# Altium schematic sheet JD1759S-NF-DIS.SCHDOC
size C
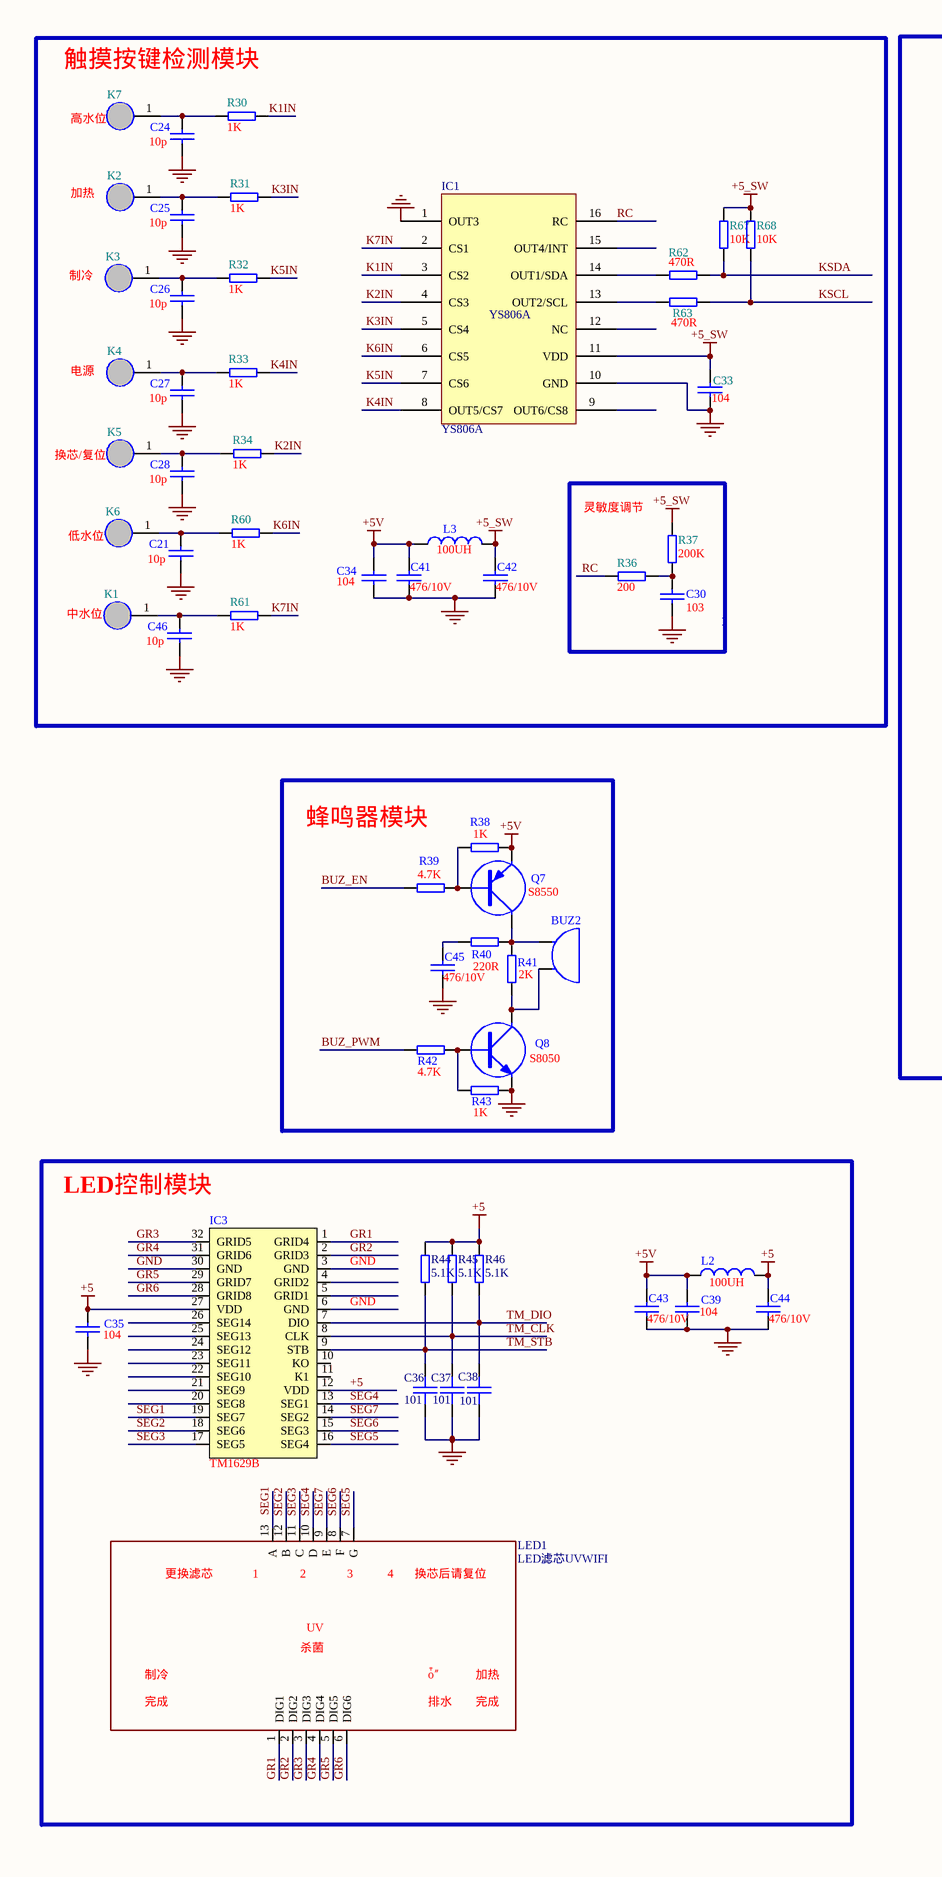
[diagram p0: JD1759S-NF-DIS.SCHDOC, left]
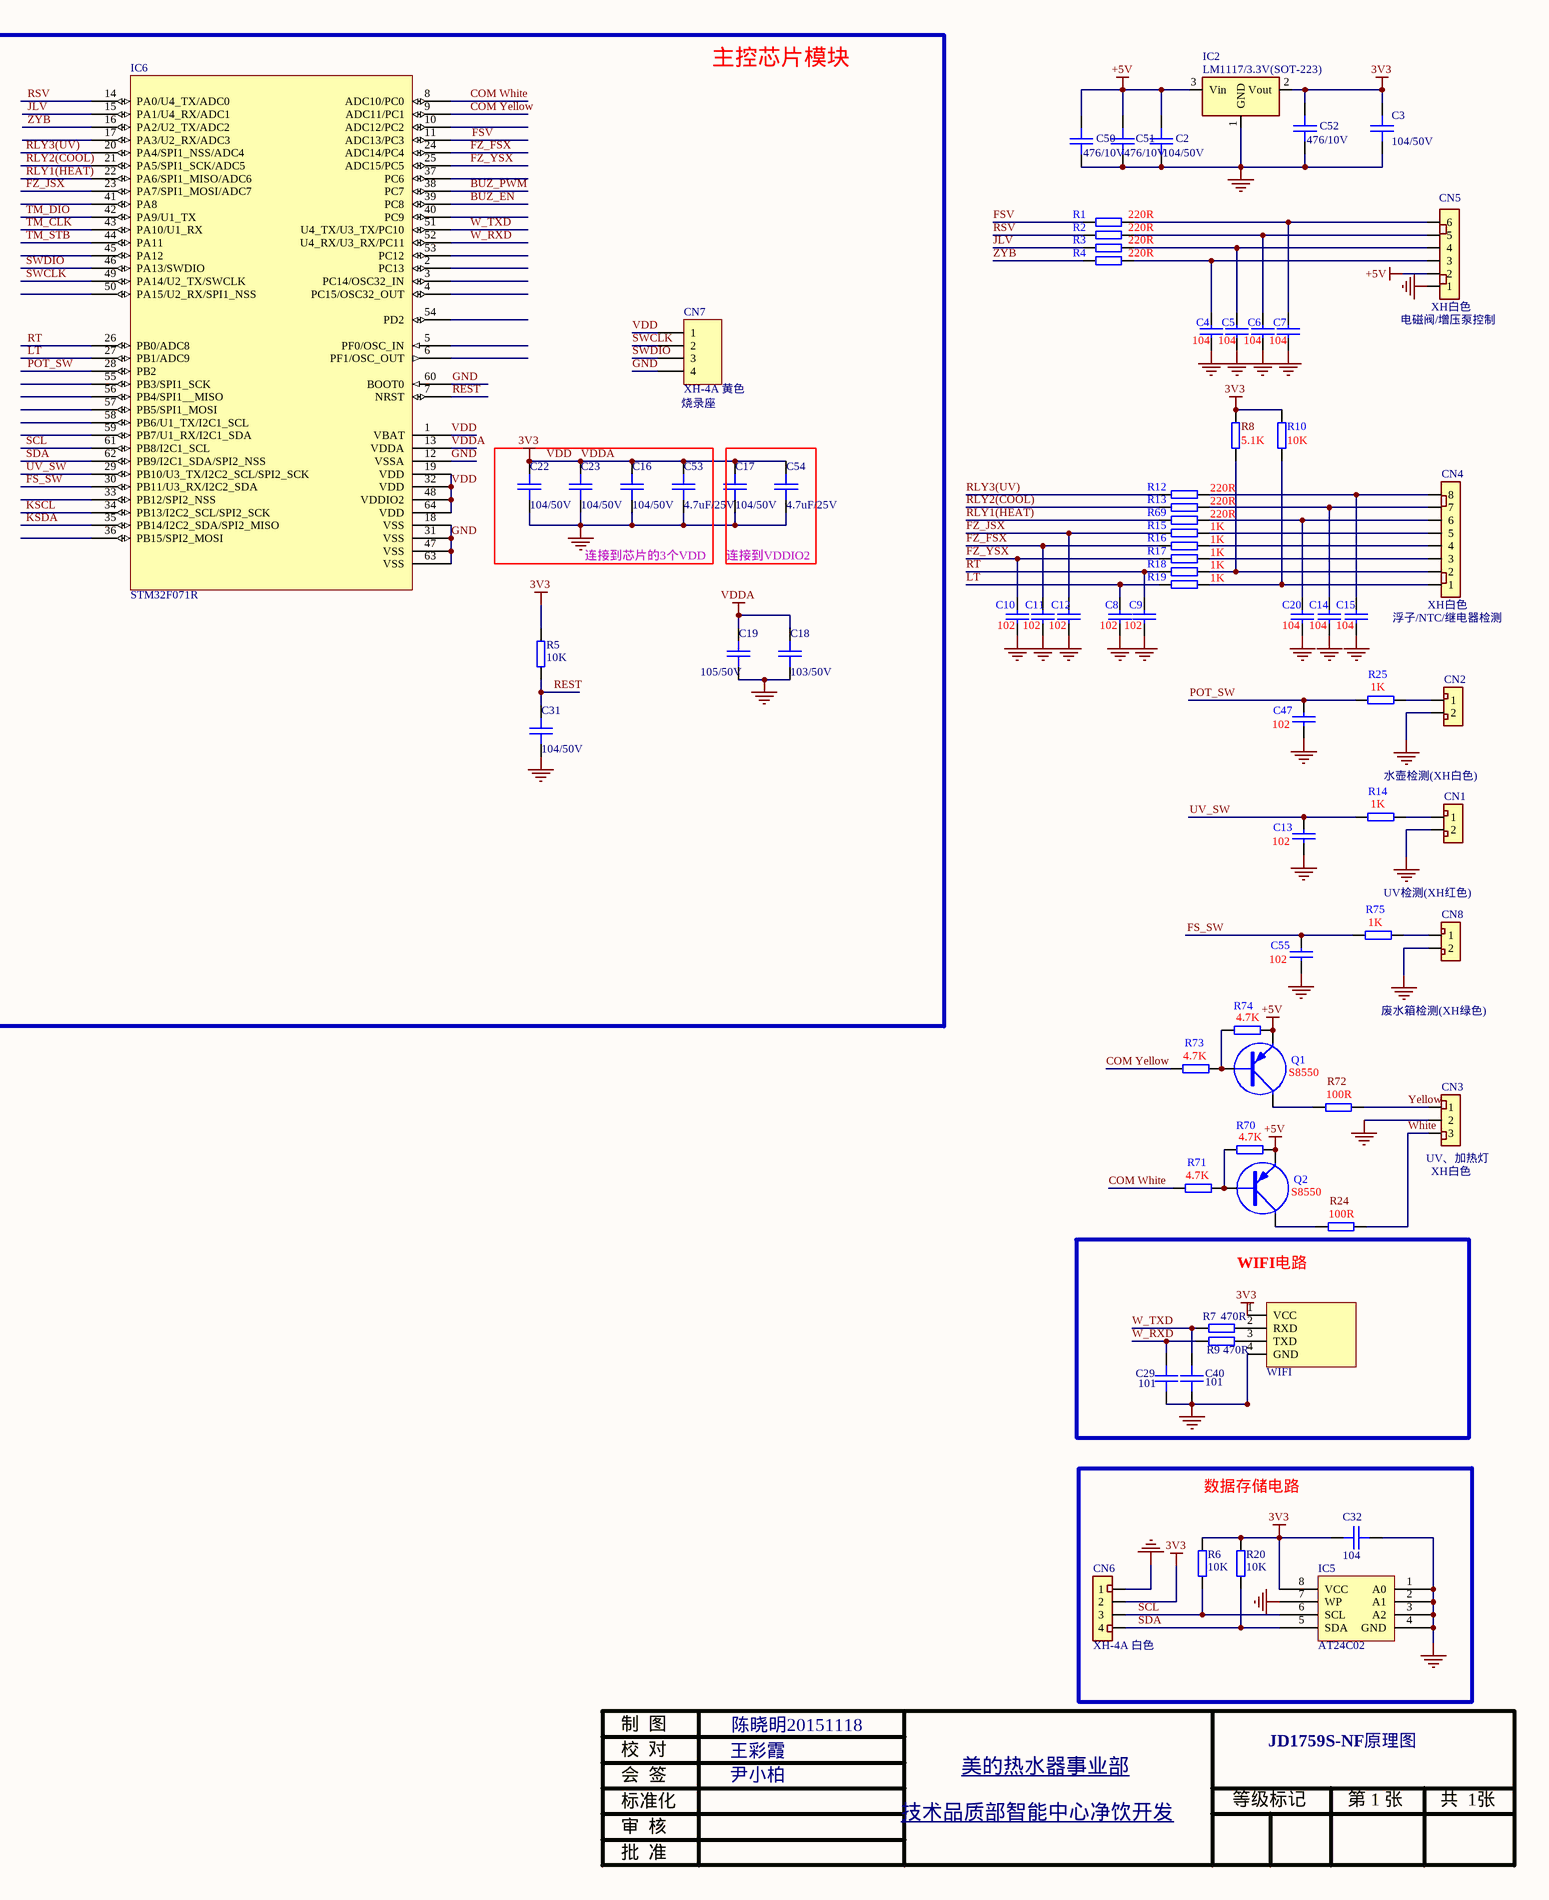
[diagram p1: JD1759S-NF-DIS.SCHDOC, right]

## Parts
BUZ2  (no value)  [BUZ1]
C2  104/50V  [C0805XG]
C3  104/50V  [C0805XG]
C4  104  [C0805XG]
C5  104  [C0805XG]
C6  104  [C0805XG]
C7  104  [C0805XG]
C8  102  [C0805XG]
C9  102  [C0805XG]
C10  102  [C0805XG]
C11  102  [C0805XG]
C12  102  [C0805XG]
C13  102  [C0805XG]
C14  104  [C0805XG]
C15  104  [C0805XG]
C16  104/50V  [C0805XG]
C17  104/50V  [C0805XG]
C18  103/50V  [C0805XG]
C19  105/50V  [C0805XG]
C20  104  [C0805XG]
C21  10p  [C0805XG]
C22  104/50V  [C0805XG]
C23  104/50V  [C0805XG]
C24  10p  [C0805XG]
C25  10p  [C0805XG]
C26  10p  [C0805XG]
C27  10p  [C0805XG]
C28  10p  [C0805XG]
C29  101  [C0805XG]
C30  103  [C0805XG]
C31  104/50V  [C0805XG]
C32  104  [C0805XG]
C33  104  [C0805XG]
C34  104  [C0805XG]
C35  104  [C0805XG]
C36  101  [C0805XG]
C37  101  [C0805XG]
C38  101  [C0805XG]
C39  104  [C0805XG]
C40  101  [C0805XG]
C41  476/10V  [C1206]
C42  476/10V  [C1206]
C43  476/10V  [C1206]
C44  476/10V  [C1206]
C45  476/10V  [C1206]
C46  10p  [C0805XG]
C47  102  [C0805XG]
C50  476/10V  [C1206]
C51  476/10V  [C1206]
C52  476/10V  [C1206]
C53  4.7uF/25V  [C0805XG]
C54  4.7uF/25V  [C0805XG]
C55  102  [C0805XG]
CN1  CN2  [CN2]  (value not drawn)
CN2  CN2  [CN2]  (value not drawn)
CN3  CN3  [CN3]  (value not drawn)
CN4  XH白色  [CN8]
CN5  XH白色  [CN6]
CN6  XH-4A 白色  [CN4]
CN7  XH-4A 黄色  [CN4]
CN8  CN2  [CN2]  (value not drawn)
IC1  YS806A  [SOP16]
IC2  LM1117/3.3V(SOT-223)  [SOT-223]
IC3  TM1629B  [SOP32]
IC4  WIFI  [WIFI]
IC5  AT24C02  [SOP8]
IC6  STM32F071R  [QFP64(0.5MM)]
K1  中水位  [KEY-T1 - 12]
K2  加热  [KEY-T1 - 12]
K3  制冷  [KEY-T1 - 12]
K4  电源  [KEY-T1 - 12]
K5  换芯/复位  [KEY-T1 - 12]
K6  低水位  [KEY-T1 - 12]
K7  高水位  [KEY-T1 - 12]
L2  100UH  [L100-5.7]
L3  100UH  [R1210]
LED1  LED滤芯UVWIFI  [LED滤芯UVWIFI]
Q1  S8550  [SOT23-BCE]
Q2  S8550  [SOT23-BCE]
Q7  S8550  [SOT23-BCE]
Q8  S8050  [SOT23-BCE]
R1  220R  [R0805XG]
R2  220R  [R0805XG]
R3  220R  [R0805XG]
R4  220R  [R0805XG]
R5  10K  [R0805XG]
R6  10K  [R0805XG]
R7  470R  [R0805XG]
R8  5.1K  [R0805XG]
R9  470R  [R0805XG]
R10  10K  [R0805XG]
R12  220R  [R0805XG]
R13  220R  [R0805XG]
R14  1K  [R0805XG]
R15  1K  [R0805XG]
R16  1K  [R0805XG]
R17  1K  [R0805XG]
R18  1K  [R0805XG]
R19  1K  [R0805XG]
R20  10K  [R0805XG]
R24  100R  [R1206]
R25  1K  [R0805XG]
R30  1K  [R0805XG]
R31  1K  [R0805XG]
R32  1K  [R0805XG]
R33  1K  [R0805XG]
R34  1K  [R0805XG]
R36  200  [R0805XG]
R37  200K  [R0805XG]
R38  1K  [R0805XG]
R39  4.7K  [R0805XG]
R40  220R  [R0805XG]
R41  2K  [R0805XG]
R42  4.7K  [R0805XG]
R43  1K  [R0805XG]
R44  5.1K  [R0805XG]
R45  5.1K  [R0805XG]
R46  5.1K  [R0805XG]
R60  1K  [R0805XG]
R61  1K  [R0805XG]
R62  470R  [R0805XG]
R63  470R  [R0805XG]
R67  10K  [R0805XG]
R68  10K  [R0805XG]
R69  220R  [R0805XG]
R70  4.7K  [R0805XG]
R71  4.7K  [R0805XG]
R72  100R  [R1206]
R73  4.7K  [R0805XG]
R74  4.7K  [R0805XG]
R75  1K  [R0805XG]

## Blocks framed on the sheet
触摸按键检测模块: C21 C24-C28 C30 C33 C34 C41 C42 C46 IC1 K1-K7 L3 R30-R34 R36 R37 R60-R63 R67 R68
主控芯片模块: C18 C19 C31 CN7 IC6 R5
连接到芯片的3个VDD: C16 C22 C23 C53
连接到VDDIO2: C17 C54
蜂鸣器模块: BUZ2 C45 Q7 Q8 R38-R43
LED控制模块: C35-C39 C43 C44 IC3 L2 LED1 R44-R46
WIFI电路: C29 C40 IC4 R7 R9
数据存储电路: C32 CN6 IC5 R6 R20

## Nets
+5: C35.2 C44.2 IC3.12(VDD) IC3.27(VDD) L2.1 R44.2 R45.2 R46.2
+5_SW: C33.2 C42.2 IC1.11(VDD) L3.1 R37.1 R67.1 R68.1
+5V: C2.2 C34.2 C39.2 C41.2 C43.2 C50.2 C51.2 CN5.2 IC2.3(Vin) L2.2 L3.2 Q1.E Q2.E Q7.E R38.2 R70.2 R74.2
GND: C2.1 C3.2 C4.2 C5.2 C6.2 C7.2 C8.2 C9.2 C10.2 C11.2 C12.2 C13.2 C14.2 C15.2 C16.1 C17.1 C18.1 C19.1 C20.2 C21.2 C22.1 C23.1 C24.2 C25.2 C26.2 C27.2 C28.2 C29.1 C30.2 C31.1 C32.2 C33.1 C34.1 C35.1 C36.1 C37.1 C38.1 C39.1 C40.1 C41.1 C42.1 C43.1 C44.1 C45.1 C46.2 C47.2 C50.1 C51.1 C52.1 C53.1 C54.1 C55.2 CN1.2 CN2.2 CN3.2 CN5.1 CN6.1 CN7.4 CN8.2 IC1.1(OUT3) IC1.10(GND) IC2.1(GND) IC3.3(GND) IC3.6(GND) IC3.30(GND) IC4.4(GND) IC5.1(A0) IC5.2(A1) IC5.3(A2) IC5.4(GND) IC5.7(WP) IC6.12(VSSA) IC6.18(VSS) IC6.31(VSS) IC6.47(VSS) IC6.60(BOOT0) IC6.63(VSS) Q8.E R43.1
VDD: C3.1 C16.2 C17.2 C18.2 C19.2 C22.2 C23.2 C32.1 C52.2 C53.2 C54.2 CN6.2 CN7.1 IC2.2(Vout) IC4.1(VCC) IC5.8(VCC) IC6.1(VBAT) IC6.13(VDDA) IC6.19(VDD) IC6.32(VDD) IC6.48(VDDIO2) IC6.64(VDD) R5.1 R6.2 R8.2 R10.2 R20.2  [also labelled 3V3, VDDA]
BUZ_EN: IC6.39(PC8) R39.1
BUZ_PWM: IC6.38(PC7) R42.1
COM White: IC6.8(ADC10/PC0) R71.1
COM Yellow: IC6.9(ADC11/PC1) R73.1
FS_SW: C55.1 IC6.30(PB11/U3_RX/I2C2_SDA) R75.2
FSV: IC6.11(ADC13/PC3) R1.2
FZ_FSX: C11.1 IC6.24(ADC14/PC4) R16.2
FZ_JSX: C12.1 IC6.23(PA7/SPI1_MOSI/ADC7) R15.2
FZ_YSX: C10.1 IC6.25(ADC15/PC5) R17.2
GR1: IC3.1(GRID4) LED1.1(DIG1)
GR2: IC3.2(GRID3) LED1.2(DIG2)
GR3: IC3.32(GRID5) LED1.3(DIG3)
GR4: IC3.31(GRID6) LED1.4(DIG4)
GR5: IC3.29(GRID7) LED1.5(DIG5)
GR6: IC3.28(GRID8) LED1.6(DIG6)
JLV: IC6.15(PA1/U4_RX/ADC1) R3.2
K1IN: IC1.3(CS2) R30.2
K2IN: IC1.4(CS3) R34.1
K3IN: IC1.5(CS4) R31.1
K4IN: IC1.8(OUT5/CS7) R33.1
K5IN: IC1.7(CS6) R32.1
K6IN: IC1.6(CS5) R60.1
K7IN: IC1.2(CS1) R61.1
KSCL: IC6.34(PB13/I2C2_SCL/SPI2_SCK) R63.1 R68.2
KSDA: IC6.35(PB14/I2C2_SDA/SPI2_MISO) R62.1 R67.2
LT: C8.1 IC6.27(PB1/ADC9) R19.2
POT_SW: C47.1 IC6.28(PB2) R25.2
RC: IC1.16(RC) R36.1
REST: C31.2 IC6.7(NRST) R5.2
RLY1(HEAT): IC6.22(PA6/SPI1_MISO/ADC6) R69.2
RLY2(COOL): IC6.21(PA5/SPI1_SCK/ADC5) R13.2
RLY3(UV): IC6.20(PA4/SPI1_NSS/ADC4) R12.2
RSV: IC6.14(PA0/U4_TX/ADC0) R2.2
RT: C9.1 IC6.26(PB0/ADC8) R18.2
SCL: CN6.3 IC5.6(SCL) IC6.61(PB8/I2C1_SCL) R6.1
SDA: CN6.4 IC5.5(SDA) IC6.62(PB9/I2C1_SDA/SPI2_NSS) R20.1
SEG1: IC3.19(SEG7) LED1.13(A)
SEG2: IC3.18(SEG6) LED1.12(B)
SEG3: IC3.17(SEG5) LED1.11(C)
SEG4: IC3.13(SEG1) LED1.10(D)
SEG5: IC3.16(SEG4) LED1.7(G)
SEG6: IC3.15(SEG3) LED1.8(F)
SEG7: IC3.14(SEG2) LED1.9(E)
SWCLK: CN7.2 IC6.49(PA14/U2_TX/SWCLK)
SWDIO: CN7.3 IC6.46(PA13/SWDIO)
TM_CLK: C37.2 IC3.8(CLK) IC6.43(PA10/U1_RX) R45.1
TM_DIO: C38.2 IC3.7(DIO) IC6.42(PA9/U1_TX) R46.1
TM_STB: C36.2 IC3.9(STB) IC6.44(PA11) R44.1
UV_SW: C13.1 IC6.29(PB10/U3_TX/I2C2_SCL/SPI2_SCK) R14.2
W_RXD: C29.2 IC6.52(U4_RX/U3_RX/PC11) R9.2
W_TXD: C40.2 IC6.51(U4_TX/U3_TX/PC10) R7.2
White: CN3.3 R24.2
Yellow: CN3.1 R72.2
ZYB: IC6.16(PA2/U2_TX/ADC2) R4.2
NetBUZ2_1: BUZ2.1 Q7.C R40.1 R41.2
NetBUZ2_2: BUZ2.2 Q8.C R41.1
NetC4_1: C4.1 CN5.3 R4.1
NetC5_1: C5.1 CN5.4 R3.1
NetC6_1: C6.1 CN5.5 R2.1
NetC7_1: C7.1 CN5.6 R1.1
NetC14_1: C14.1 CN4.7 R13.1
NetC15_1: C15.1 CN4.8 R12.1
NetC20_1: C20.1 CN4.6 R69.1
NetC21_1: C21.1 K6.1(TOUCH_KEY) R60.2
NetC24_1: C24.1 K7.1(TOUCH_KEY) R30.1
NetC25_1: C25.1 K2.1(TOUCH_KEY) R31.2
NetC26_1: C26.1 K3.1(TOUCH_KEY) R32.2
NetC27_1: C27.1 K4.1(TOUCH_KEY) R33.2
NetC28_1: C28.1 K5.1(TOUCH_KEY) R34.2
NetC30_1: C30.1 R36.2 R37.2
NetC45_2: C45.2 R40.2
NetC46_1: C46.1 K1.1(TOUCH_KEY) R61.2
NetCN1_1: CN1.1 R14.1
NetCN2_1: CN2.1 R25.1
NetCN4_1: CN4.1 R10.1 R19.1
NetCN4_2: CN4.2 R8.1 R18.1
NetCN4_3: CN4.3 R17.1
NetCN4_4: CN4.4 R16.1
NetCN4_5: CN4.5 R15.1
NetCN8_1: CN8.1 R75.1
NetIC1_13: IC1.13(OUT2/SCL) R63.2
NetIC1_14: IC1.14(OUT1/SDA) R62.2
NetIC4_2: IC4.2(RXD) R7.1
NetIC4_3: IC4.3(TXD) R9.1
NetQ1_B: Q1.B R73.2 R74.1
NetQ1_C: Q1.C R72.1
NetQ2_B: Q2.B R70.1 R71.2
NetQ2_C: Q2.C R24.1
NetQ7_B: Q7.B R38.1 R39.2
NetQ8_B: Q8.B R42.2 R43.2

Not connected (* = marked no-connect by the designer): IC1 9(OUT6/CS8) 12(NC) 15(OUT4/INT); IC3 4(GRID2) 5(GRID1) 10(KO) 11(K1) 20(SEG8) 21(SEG9) 22(SEG10) 23(SEG11) 24(SEG12) 25(SEG13) 26(SEG14); IC6 2(PC13) 3(PC14/OSC32_IN) 4(PC15/OSC32_OUT) 5(PF0/OSC_IN) 6(PF1/OSC_OUT) 10(ADC12/PC2) 17(PA3/U2_RX/ADC3) 33(PB12/SPI2_NSS) 36(PB15/SPI2_MOSI) 37(PC6) 40(PC9) 41(PA8) 45(PA12) 50(PA15/U2_RX/SPI1_NSS) 53(PC12) 54(PD2) 55(PB3/SPI1_SCK) 56(PB4/SPI1__MISO) 57(PB5/SPI1_MOSI) 58(PB6/U1_TX/I2C1_SCL) 59(PB7/U1_RX/I2C1_SDA)

## Notes on the sheet
- (near CN5) 电磁阀/增压泵控制
- (near CN7) 烧录座
- 灵敏度调节
- 浮子/NTC/继电器检测
- 水壶检测(XH白色)
- UV检测(XH红色)
- 废水箱检测(XH绿色)
- (near CN3) UV、加热灯
- (near CN3) XH白色
- 制  图
- 陈晓明20151118
- 校  对
- 会  签
- 王彩霞
- 尹小柏
- 美的热水器事业部
- JD1759S-NF原理图
- 标准化
- 审  核
- 批  准
- 技术品质部智能中心净饮开发
- 等级标记
- 第 1 张
- 共  1张
- (in symbol LED滤芯UVWIFI) 更换滤芯; 换芯后请复位; UV; 杀菌; 制冷; ȱˮ; 加热; 完成; 排水

## Library data of the parts
BUZ2 = BUZZER
C2 C16-C19 C22 C23 C29 C31 C32 C40 C50-C54 = Cap: Capacitor
C3 = Cap: Capacitor (Semiconductor SIM Model); Published: *; LatestRevisionDate: *; LatestRevisionNote: *; PackageReference: *; Publisher: *
C4-C15 C20 C21 C24-C28 C46 C47 C55 = CAP: Capacitor
C30 C34-C39 C41-C45 = CAP
C33 = C
CN4 = CN8
CN5 = CN6
CN6 = CN4
CN7 = Header 4: Header, 4-Pin; LatestRevisionDate: 17-Jul-2002; LatestRevisionNote: Re-released for DXP Platform.; Publisher: Altium Limited
IC2 = SOT-223
IC5 = Component_1
K1-K7 = 1P-TOUCH
L2 L3 = L-B: LOOP
LED1 = LED滤芯UVWIFI: LED888
Q1 Q2 Q7 = PNP
Q8 = NPN
R1-R10 R12-R20 R24 R25 R30-R34 R36-R46 R60-R63 R67-R75 = RES1: RES